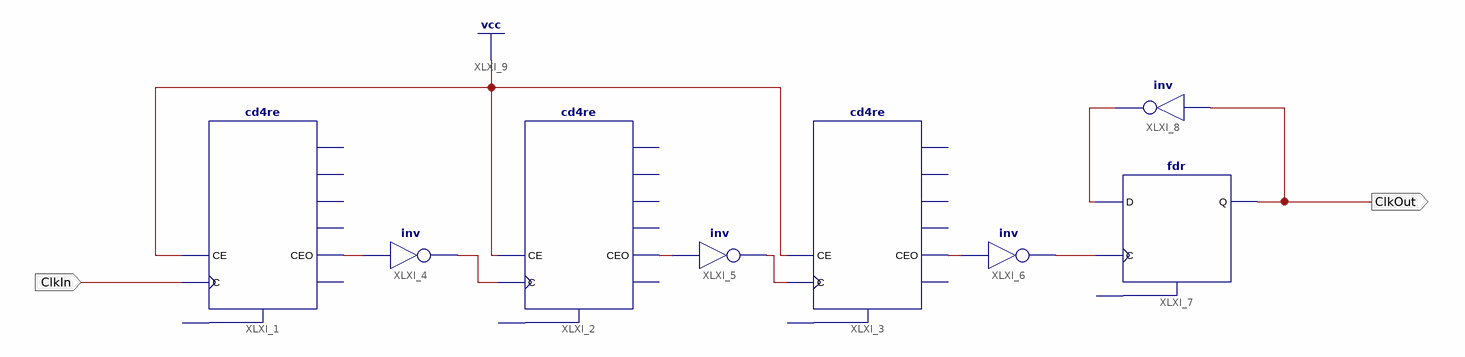
[diagram p0: schematic sheet 1]
// Xilinx ISE schematic Divider.sch (spartan6) as structural Verilog: 8 symbols, 2 ports
module Divider (
  input  ClkIn,
  output ClkOut
);

  wire XLXN_1, XLXN_2, XLXN_3, XLXN_4, XLXN_5, XLXN_6, XLXN_8;

  cd4re XLXI_1 (.C(ClkIn), .CE(1'b1), .CEO(XLXN_1));  // open: R, Q0, Q1, Q2, Q3, TC
  cd4re XLXI_2 (.C(XLXN_2), .CE(1'b1), .CEO(XLXN_3));  // open: R, Q0, Q1, Q2, Q3, TC
  cd4re XLXI_3 (.C(XLXN_4), .CE(1'b1), .CEO(XLXN_5));  // open: R, Q0, Q1, Q2, Q3, TC
  not XLXI_4 (XLXN_2, XLXN_1);
  not XLXI_5 (XLXN_4, XLXN_3);
  not XLXI_6 (XLXN_6, XLXN_5);
  fdr XLXI_7 (.C(XLXN_6), .D(XLXN_8), .Q(ClkOut));  // open: R
  not XLXI_8 (XLXN_8, ClkOut);
endmodule
